# Altium schematic sheet Sheet1.SchDoc
size A; SheetNumber: 1; SheetTotal: 1
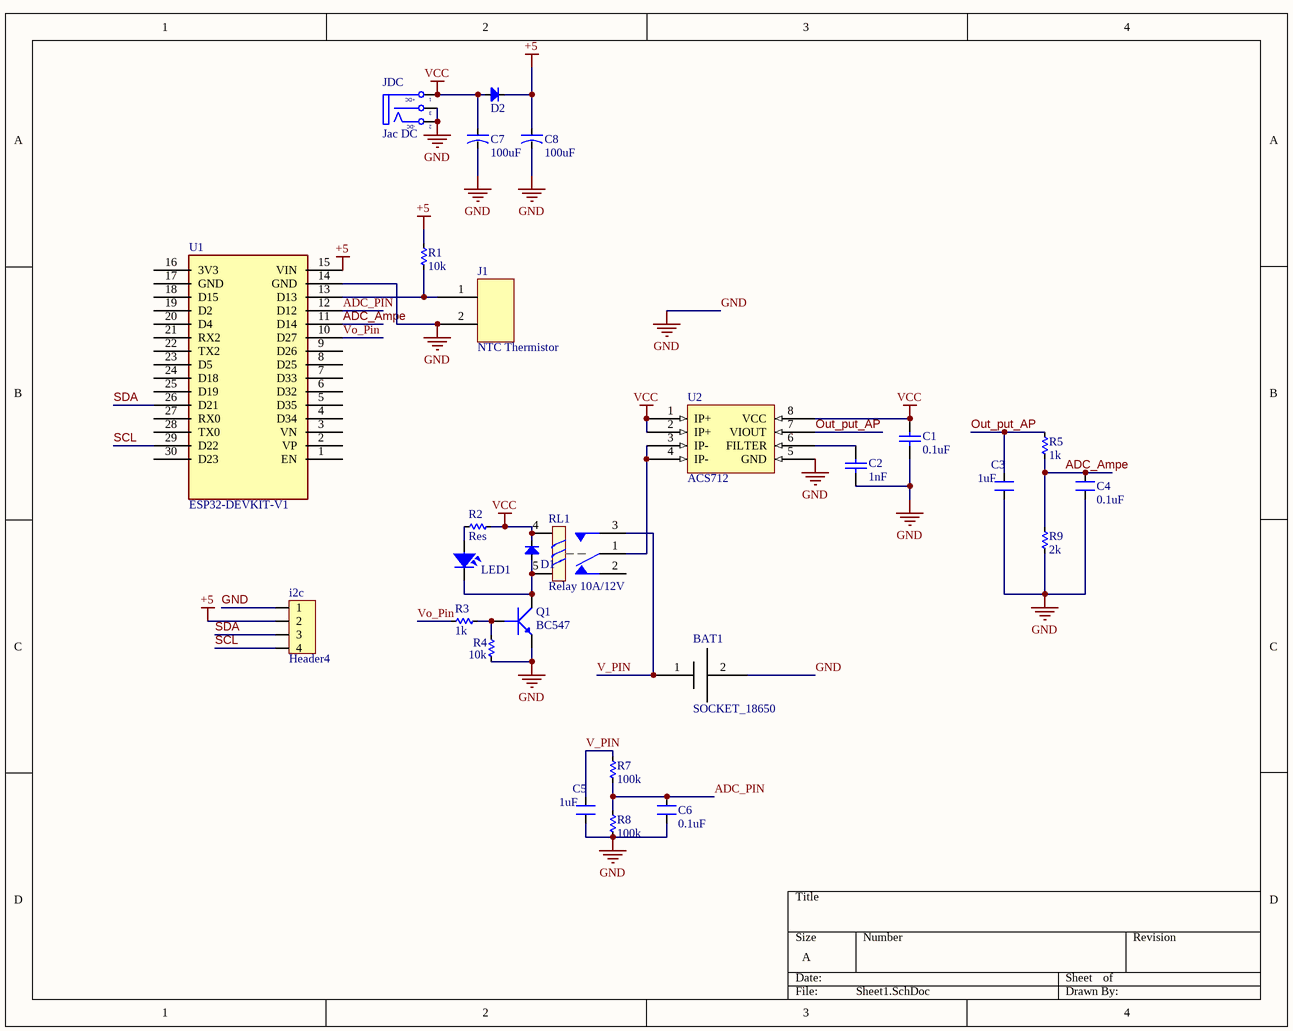
[diagram p0: Sheet1.SchDoc]

## Parts
BAT1  SOCKET_18650  [SOCKET_18650_1PIN]
C1  0.1uF  [CAPC_0603_N]
C2  1nF  [CAPC_0603_N]
C3  1uF  [CN1]
C4  0.1uF  [CN1]
C5  1uF  [CN1]
C6  0.1uF  [CN1]
C7  100uF  [CA-ALU-6.3]
C8  100uF  [CA-ALU-6.3]
D1  Diode  [DIO-1A]  (value not drawn)
D2  Diode  [DIO-1A]  (value not drawn)
i2c  Header4  [Header4]
J1  NTC Thermistor  [NTC Thermistor]
JDC  Jac DC  [DC0]
LED1  LED  [LED-5-Green]  (value not drawn)
Q1  BC547  [TO-92]
R1  10k  [RES-1/4W]
R2  Res  [RES-1/4W]
R3  1k  [RES-1/4W]
R4  10k  [RES-1/4W]
R5  1k  [RES-1/4W]
R7  100k  [RES-1/4W]
R8  100k  [RES-1/4W]
R9  2k  [RES-1/4W]
RL1  Relay 10A/12V  [RELAY 5]
U1  ESP32-DEVKIT-V1  [ESP32-DEVKIT-V1]  (no BOM)
U2  ACS712  [ACS712]

## Nets
+5: C8.1 D2.2(K) i2c.2 R1.2 U1.15(VIN)
GND: BAT1.2(GND) C1.1 C2.1 C3.1 C4.1 C5.1 C6.1 C7.2 C8.2 i2c.1 J1.2 JDC.2(TN) JDC.3(S) Q1.3(E) R4.1 R8.1 R9.1 U1.14(GND) U2.5(GND)
VCC: C1.2 C7.1 D1.2(K) D2.1(A) JDC.1(T) R2.2 RL1.4 U2.1(IP+) U2.2(IP+) U2.8(VCC)
ADC_Ampe: C4.2 R5.1 R9.2 U1.11(D14)
ADC_PIN: C6.2 R7.1 R8.2 U1.12(D12)
Out_put_AP: C3.2 R5.2 U2.7(VIOUT)
SCL: i2c.4 U1.29(D22)
SDA: i2c.3 U1.26(D21)
V_PIN: BAT1.1(VCC) C5.2 R7.2 RL1.3
Vo_Pin: R3.2 U1.10(D27)
NetC2_2: C2.2 U2.6(FILTER)
NetD1_1: D1.1(A) LED1.2 Q1.1(C) RL1.5
NetJ1_1: J1.1 R1.1 U1.13(D13)
NetLED1_1: LED1.1 R2.1
NetQ1_2: Q1.2(B) R3.1 R4.2
NetRL1_1: RL1.1 U2.3(IP-) U2.4(IP-)

Not connected (* = marked no-connect by the designer): RL1 2; U1 1(EN) 2(VP) 3(VN) 4(D34) 5(D35) 6(D32) 7(D33) 8(D25) 9(D26) 16(3V3) 17(GND) 18(D15) 19(D2) 20(D4) 21(RX2) 22(TX2) 23(D5) 24(D18) 25(D19) 27(RX0) 28(TX0) 30(D23)

## Notes on the sheet
- (in symbol DCIN) +DC; -DC

## Library data of the parts
BAT1 = SOCKET_18650_1PIN
C1 C2 = C0603X7R104K500NT: CAP CER 0.1UF 50V X7R 0603; Manufacture: Hottech; Detailed Value: 0.1uF - 50V - 0603; PROJECT: KHO; Partnumber: C0603X7R104K500NT; Value: 0.1uF; Creator: ThangND; Category: Capacitor; Mounting type: SMD
C3-C6 = CN1: Cap np  1pF - 472pF; Value: 100pF
C7 C8 = CN-ALU-DIP: Capacitor (Semiconductor SIM Model); Value: 104; LatestRevisionDate: 17-Jul-2002; LatestRevisionNote: Re-released for DXP Platform.; PackageReference: C1206; Publisher: Altium Limited
D1 D2 = Diode: Default Diode; Code - JEDEC: DO-214-AB; Value: 1N5007; Published: 8-Jun-2000; Revision: July-2002: Re-released for DXP Platform.; Publisher: Altium Limited
i2c = Header4: Header IDC, 4 x 1 Pin Vertical 2.54mm Pitch (Non-Boxed, Male); Manufacturer: W¨¹rth Elektronik eiSos GmbH; partNo: 613002143121; ComponentLink1 Description: Manufacturer; ComponentLink2 Description: Datasheet; NoPins: 02; Created Date: 29 March 2013; ComponentLink1URL: http://www.we-online.com; ComponentLink2URL: http://katalog.we-online.de/em/datasheet/6130xx143121.pdf; Created by: Karrer Zheng
JDC = DCIN: Jac DC input; Value: Jac DC
LED1 = LED: LED Single colour Green and Red; Value: LED 3 ly Single Colour
Q1 = BC547: Transistors - BJT NPN 45V 100mA; DataSheet: https://www.mouser.vn/datasheet/2/308/1/BC550_D-2310266.pdf
R1-R5 R7-R9 = Res: Manufacturer: Generic Components; Class: Passive; SubClass: R; Published: 08/06/2000; Publisher: Altium Hobart Technology Centre
RL1 = Relay 5: Relay SPDT,10A - 12VDC 5 Pin; Value: Relay SPDT, 10A, 12V
U1 = ESP32-DEVKIT-V1: ESP32-DEVKIT-V1 30Pin
U2 = ACS712: 5A SOIC-8 Current Sensors ROHS